# Altium schematic sheet 03_MCU.SchDoc: Microcontroller
size A4; Author: Sasa Karanovic; Organization: Altium Limited; Revision: 04; SheetNumber: 3; SheetTotal: 4; PrjDate: 2023-09-29; PrjTime: 23:04; PrjName: OpenFAN Micro
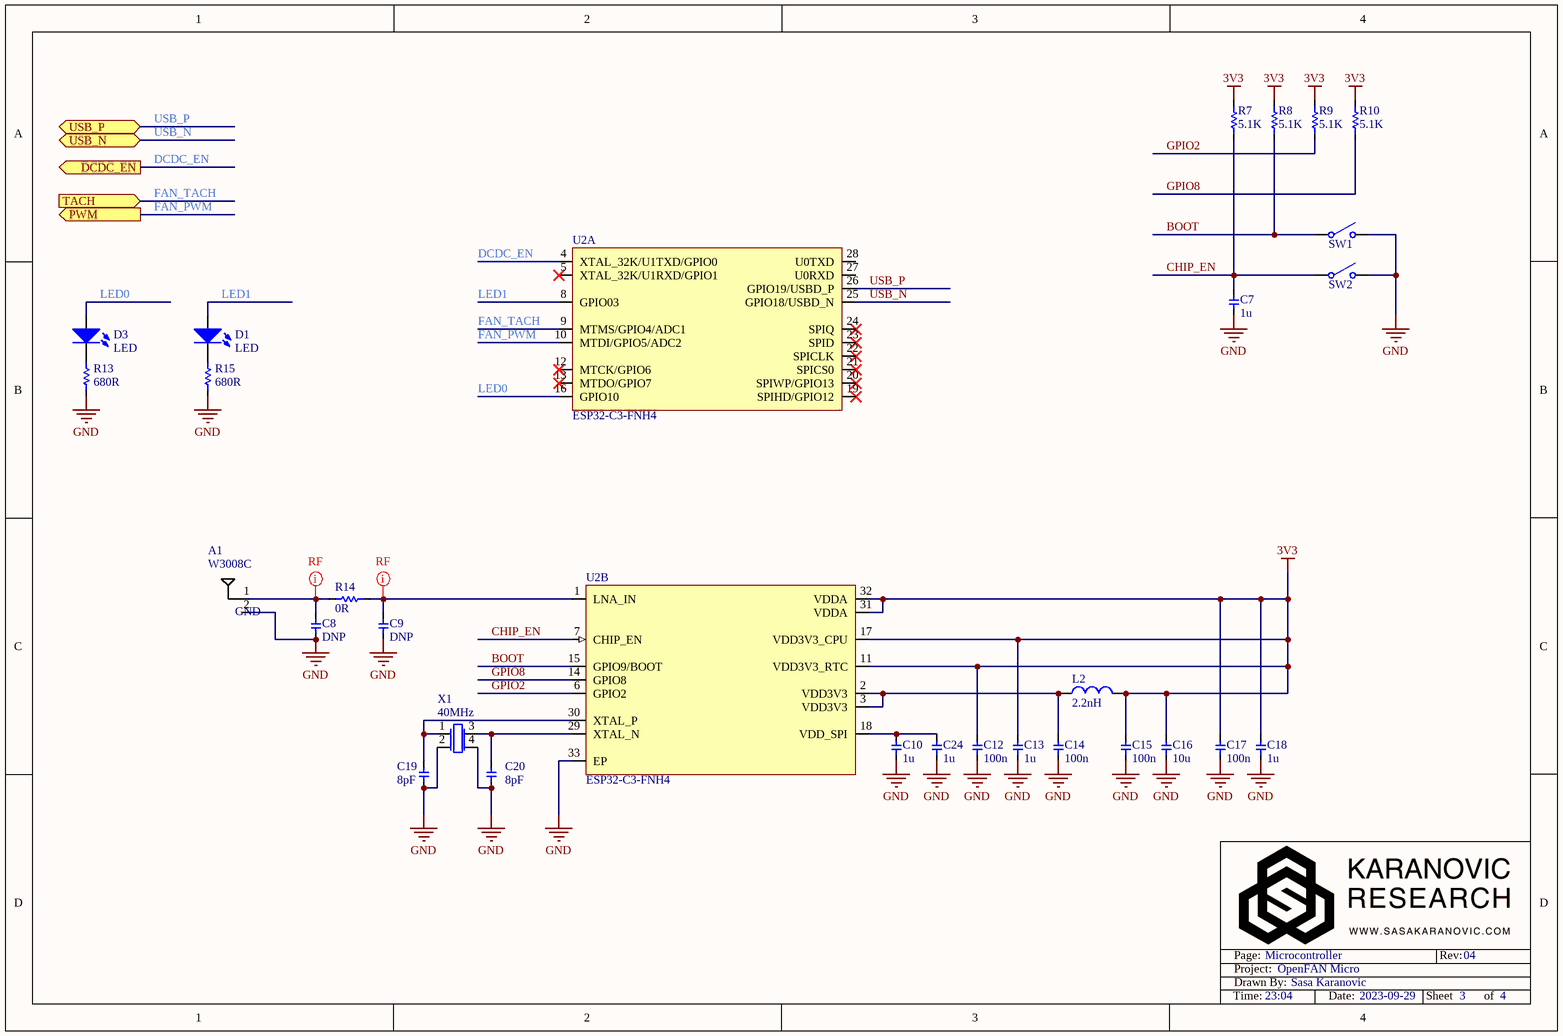
[diagram p0: 03_MCU.SchDoc]

## Parts
A1  value W3008C  [W3008C]  (hidden comment: Antenna)
C7  value 1u  [0402]  (hidden comment: Cap)
C8  value DNP  [0402]  (hidden comment: Cap)  (no BOM)
C9  value DNP  [0402]  (hidden comment: Cap)  (no BOM)
C10  value 1u  [0402]  (hidden comment: Cap)
C12  value 100n  [0402]  (hidden comment: Cap)
C13  value 1u  [0402]  (hidden comment: Cap)
C14  value 100n  [0402]  (hidden comment: Cap)
C15  value 100n  [0402]  (hidden comment: Cap)
C16  value 10u  [0402]  (hidden comment: Cap)
C17  value 100n  [0402]  (hidden comment: Cap)
C18  value 1u  [0402]  (hidden comment: Cap)
C19  value 8pF  [0402]  (hidden comment: Cap)
C20  value 8pF  [0402]  (hidden comment: Cap)
C24  value 1u  [0402]  (hidden comment: Cap)
D1  LED  [CD1608-0603]
D3  LED  [CD1608-0603]
L2  value 2.2nH  [0402]  (hidden comment: Inductor)
R7  value 5.1K  [0402]  (hidden comment: Res)
R8  value 5.1K  [0402]  (hidden comment: Res)
R9  value 5.1K  [0402]  (hidden comment: Res)
R10  value 5.1K  [0402]  (hidden comment: Res)
R13  value 680R  [0402]  (hidden comment: Res)
R14  value 0R  [0402]  (hidden comment: Res)
R15  value 680R  [0402]  (hidden comment: Res)
SW1  Switch  [Switch-XDTD-0304-215]  (value not drawn)
SW2  Switch  [Switch-XDTD-0304-215]  (value not drawn)
U2  ESP32-C3-FNH4  [QFN50P500X500X100_HS-33N]  (parts A,B of 2)
X1  40MHz  [XTAL-4LEAD-2016]

## Ports
DCDC_EN (out), PWM (out), TACH (in), USB_N (bidir), USB_P (bidir)

## Nets
3V3: C12.2 C13.2 C15.2 C16.2 C17.2 C18.2 L2.2 R7.1 R8.1 R9.1 R10.1 U2.11(VDD3V3_RTC) U2.17(VDD3V3_CPU) U2.31(VDDA) U2.32(VDDA)
GND: A1.2 C7.1 C8.1 C9.1 C10.1 C12.1 C13.1 C14.1 C15.1 C16.1 C17.1 C18.1 C19.2 C20.1 C24.1 R13.1 R15.1 SW1.2(COMMON2) SW2.2(COMMON2) U2.33(EP) X1.2(GND) X1.4(GND)
BOOT: R8.2 SW1.1(COMMON1) U2.15(GPIO9/BOOT)
CHIP_EN: C7.2 R7.2 SW2.1(COMMON1) U2.7(CHIP_EN)
DCDC_EN: U2.4(XTAL_32K/U1TXD/GPIO0) ; port DCDC_EN
FAN_PWM: U2.10(MTDI/GPIO5/ADC2) ; port PWM
FAN_TACH: U2.9(MTMS/GPIO4/ADC1) ; port TACH
GPIO2: R9.2 U2.6(GPIO2)
GPIO8: R10.2 U2.14(GPIO8)
LED0: D3.A U2.16(GPIO10)
LED1: D1.A U2.8(GPIO03)
USB_N: U2.25(GPIO18/USBD_N) ; port USB_N
USB_P: U2.26(GPIO19/USBD_P) ; port USB_P
NetA1_1: A1.1 C8.2 R14.1
NetC9_2: C9.2 R14.2 U2.1(LNA_IN)
NetC10_2: C10.2 C24.2 U2.18(VDD_SPI)
NetC14_2: C14.2 L2.1 U2.2(VDD3V3) U2.3(VDD3V3)
NetC19_1: C19.1 U2.30(XTAL_P) X1.1(OSC1)
NetC20_2: C20.2 U2.29(XTAL_N) X1.3(OSC3)
NetD1_K: D1.K R15.2
NetD3_K: D3.K R13.2

Not connected (* = marked no-connect by the designer): U2 5(XTAL_32K/U1RXD/GPIO1)* 12(MTCK/GPIO6)* 13(MTDO/GPIO7)* 19(SPIHD/GPIO12)* 20(SPIWP/GPIO13)* 21(SPICS0)* 22(SPICLK)* 23(SPID)* 24(SPIQ)* 27(U0RXD) 28(U0TXD)

## Layout directives
net class RF: NetA1_1, NetC9_2

## Notes on the sheet
- Page:
- Drawn By:
- Project:
- Rev:
- Time:
- Date:
- Sheet
- of
- (in symbol ANT-W3008C) GND

## Library data of the parts
A1 = ANT-W3008C: 2.4GHz Bluetooth, WLAN, Zigbee™ Chip RF Antenna 2.4GHz ~ 2.483GHz 1.3dBi Solder Surface Mount; Manufacturer: Pulse Electronics; Manufacturer Part Number: W3008C; Distributor: LCSC; Distributor Part Number: C581403
C7 C10 C13 C18 C24 = Cap: Capacitor; Manufacturer: Samsung Electro-Mechanics; Manufacturer Part Number: CL05A105KO5NNNC; Temp Rating: X5R; Voltage: 16V; Distributor Part Number: C29266; Distributor: LCSC
C8 C9 = Cap: Capacitor
C12 C14 C15 C17 = Cap: Capacitor; Manufacturer: Samsung Electro-Mechanics; Manufacturer Part Number: CL05B104KA5NNNC; Temp Rating: X7R; Voltage: 25V; Distributor Part Number: C155422; Distributor: LCSC
C16 = Cap: Capacitor; Manufacturer: Murata Electronics; Manufacturer Part Number: GRM155R61A106ME11D; Voltage: 10V; Distributor Part Number: C408132; Distributor: LCSC
C19 C20 = Cap: Capacitor; Manufacturer: Samsung Electro-Mechanics; Manufacturer Part Number: CL05C080DB51PNC; Temp Rating: NP0; Voltage: 50V; Distributor Part Number: C472443; Distributor: LCSC
D1 D3 = LED: Typical RED GaAs LED; Manufacturer: ams-OSRAM USA INC.; Manufacturer Part Number: LW Q38G-Q2OO-3K5L-1; Value: Diffused White LED; Distributor: LCSC; Distributor Part Number: C2900098
L2 = Inductor - 2.2nH: 1.1A 2.2nH 100mΩ 0603 Inductors (SMD) ROHS; Manufacturer: Murata Electronics; Manufacturer Part Number: LQG15HS2N2B02D; Distributor: LCSC; Distributor Part Number: C162540
R7-R10 = Res: Resistor; Manufacturer: YAGEO; Manufacturer Part Number: RC0402FR-075K1L; Power Rating: 100mW; Tolerance: 1%; Distributor: LCSC; Distributor Part Number: C105872
R13 R15 = Res: Resistor; Manufacturer: YAGEO; Manufacturer Part Number: RC0402FR-10680RL; Distributor: LCSC; Distributor Part Number: C6378047
R14 = Res: Resistor; Manufacturer: YAGEO; Manufacturer Part Number: RC0402JR-070RL; Power Rating: 100mW; Tolerance: 5%; Distributor: LCSC; Distributor Part Number: C60485
SW1 SW2 = Switch -XDTD-0304-215: 50mA Surface Mount SPST 100MΩ 100,000 Times 12V 160gf@±50gf SMD Tactile Switches ROHS; Manufacturer: Lian Xin Technology; Manufacturer Part Number: XDTD-0304-215; Distributor: LCSC; Distributor Part Number: C7498203
U2 = ESP32-C3-FNH4: Ultra-Low-Power SoC with RISC-V Single-Core CPU 2.4 GHz Wi-Fi (802.11 b/g/n) and Bluetooth® 5 (LE); Manufacturer: Espressif Systems; Manufacturer Part Number: ESP32-C3FH4; Distributor: LCSC; Distributor Part Number: C2858491
X1 = XTAL-40MHz-R940000171: 40MHz 9pF ±10ppm SMD2016-4P Crystals ROHS; Manufacturer: TROQ; Manufacturer Part Number: R940000171; Distributor: LCSC; Distributor Part Number: C2929402